# EAGLE design adxl362_board (EAGLE 7.2.0)
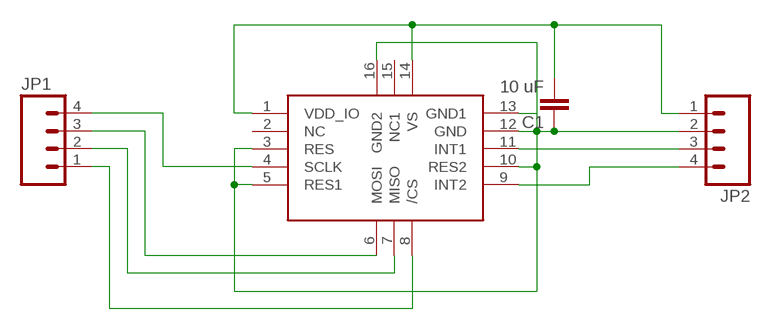
[diagram p0: schematic, sheet 1]

## Parts
C1  10 uF  CAP0805  [0805]
JP1  M041.27MM  [1X04-1.27MM]
JP2  M041.27MM  [1X04-1.27MM]
U$1  ADXL362  [ADXL362_PADS]

## Nets
N$2: C1.2 JP2.1 U$1.1(VDD_IO) U$1.14(VS)
N$3: C1.1 JP2.2 U$1.3(RES) U$1.5(RES1) U$1.10(RES2) U$1.12(GND) U$1.13(GND1) U$1.16(GND2)
N$4: JP1.4 U$1.4(SCLK)
N$5: JP2.3 U$1.11(INT1)
N$6: JP2.4 U$1.9(INT2)
N$7: JP1.3 U$1.6(MOSI)
N$8: JP1.2 U$1.7(MISO)
N$9: JP1.1 U$1.8(/CS)
Unconnected: U$1.2(NC) U$1.15(NC1)

## Library data of the parts
C1 = SparkFun-Capacitors:CAP: Capacitor Standard 0603 ceramic capacitor, and 0.1" leaded capacitor.
JP1 JP2 = SparkFun-Connectors:M04: Header 4 Standard 4-pin 0.1" header. Use with straight break away headers (SKU : PRT-00116), right angle break away headers (PRT-00553), swiss pins (PRT-00743), machine pins (PRT-00117), and female headers (PRT-00115). Molex polarized connector foot print use with SKU : PRT-08231 with associated crimp pins and housings. 1MM SMD Version SKU: PRT-10208
U$1 = sensors:ADXL362

## Board
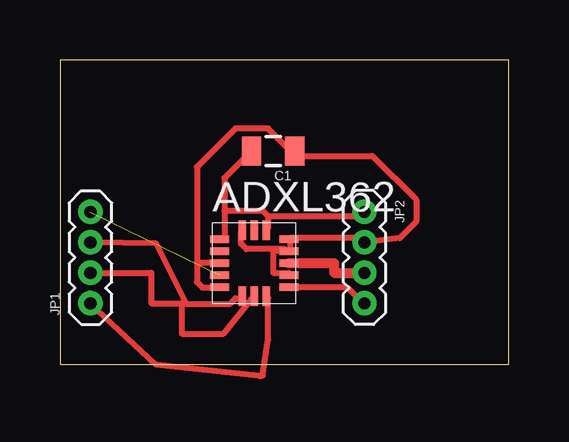
[diagram p1: board, top side]

Size 18.72 x 12.69 mm. Coordinates in mm from the lower left corner, seen from the top.
Outline: 0,0 18.72,0 18.72,12.69 0,12.69 0,0
Copper layers (1*16): Top 0.035mm / dielectric 1.5mm / Bottom 0.035mm
Design rules "default": minimum track width 10mil, minimum drill 24mil, track to track 8mil, track to pad 8mil, pad to pad 8mil, via to via 8mil, smd to smd 8mil, copper to edge 40mil, drill to drill 8mil, minimum pad ring 10mil, minimum via ring 8mil, stop-mask expansion 4mil, vias tented up to drill 0mil, thermal gap 10mil

### Footprints (pad centres in the part's own frame; a part is rotated, then mirrored left to right if it is on the bottom)
0805 = smd 0.8 x 1.2: 1 -0.9,0; 2 0.9,0
1X04-1.27MM = drill 0.508 pad 1: 1 0,0; 2 1.27,0; 3 2.54,0; 4 3.81,0
ADXL362_PADS = smd 0.8 x 0.3: 1 0.3,2.675; 2 0.3,2.175; 3 0.3,1.675; 4 0.3,1.175; 5 0.3,0.675; 9 3.2,0.675; 10 3.2,1.175; 11 3.2,1.675; 12 3.2,2.175; 13 3.2,2.675 | smd 0.3 x 0.8: 6 1.25,0.3; 7 1.75,0.3; 8 2.25,0.3; 14 2.25,3.05; 15 1.75,3.05; 16 1.25,3.05

### Placement (x,y rotation side)
C1  8.89,8.89 180 top
JP1  1.27,2.54 90 top
JP2  12.7,6.35 270 top
U$1  6.35,2.54 0 top

### Tracks (layer width: path | path; a pad name or v marks a point on that pad's centre or on a via)
N$2
  Top 0.254: 6.86,6.4 6.86,7.77 7.77,8.69 C1.2 | 6.86,6.4 6.86,5.26 U$1.1 | 8.69,6.17 8.69,5.71 U$1.14 | 8.69,6.17 8.46,6.4 6.86,6.4 | 8.69,6.17 12.68,6.17 JP2.1
N$3
  Top 0.254: 9.6,5.26 9.6,4.8 U$1.12 | U$1.16 7.54,5.49 7.54,5.03 7.77,4.8 9.37,4.8 U$1.12 | 9.6,5.26 12.68,5.26 JP2.2 14.17,5.26 14.86,5.94 14.86,6.86 13.03,8.69 9.83,8.69 C1.1 9.6,8.91 8.69,9.83 7.32,9.83 5.71,8.23 5.71,4.21 | 9.6,5.26 U$1.13 | U$1.5 6.63,3.2 5.94,3.2 5.71,3.43 5.71,4.21 | U$1.12 8.89,4.71 8.89,3.81 9.55,3.81 U$1.10 | U$1.3 5.71,4.21
N$4  (1 unrouted)
N$5
  Top 0.406: U$1.11 11.43,4.21 11.43,3.81 JP2.3
N$6
  Top 0.254: U$1.9 9.6,3.2 11.99,3.2 12.68,2.52 JP2.4
N$7
  Top 0.254: U$1.6 7.54,2.74 7.32,2.74 7.09,2.52 5.26,2.52 4.01,5.03 JP1.3
N$8
  Top 0.254: U$1.7 6.83,1.27 5.08,1.27 5.08,2.54 3.81,2.54 3.81,3.81 JP1.2
N$9
  Top 0.254: U$1.8 8.69,2.74 8.69,1.02 8.46,-0.48 8.28,-0.48 4.01,-0.03 JP1.1